# EAGLE schematic keymatrix (EAGLE 6.1)
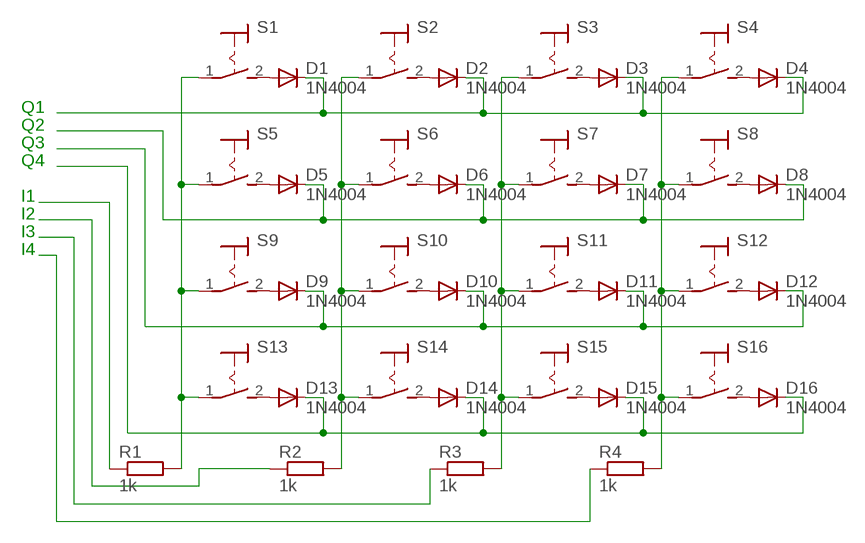
[diagram p0: schematic, sheet 1]

## Parts
D1  1N4004  [DO41-10]
D2  1N4004  [DO41-10]
D3  1N4004  [DO41-10]
D4  1N4004  [DO41-10]
D5  1N4004  [DO41-10]
D6  1N4004  [DO41-10]
D7  1N4004  [DO41-10]
D8  1N4004  [DO41-10]
D9  1N4004  [DO41-10]
D10  1N4004  [DO41-10]
D11  1N4004  [DO41-10]
D12  1N4004  [DO41-10]
D13  1N4004  [DO41-10]
D14  1N4004  [DO41-10]
D15  1N4004  [DO41-10]
D16  1N4004  [DO41-10]
R1  1k  R-EU_0204/7  [0204/7]
R2  1k  R-EU_0204/7  [0204/7]
R3  1k  R-EU_0204/7  [0204/7]
R4  1k  R-EU_0204/7  [0204/7]
S1  MS243  [MS243]
S2  MS243  [MS243]
S3  MS243  [MS243]
S4  MS243  [MS243]
S5  MS243  [MS243]
S6  MS243  [MS243]
S7  MS243  [MS243]
S8  MS243  [MS243]
S9  MS243  [MS243]
S10  MS243  [MS243]
S11  MS243  [MS243]
S12  MS243  [MS243]
S13  MS243  [MS243]
S14  MS243  [MS243]
S15  MS243  [MS243]
S16  MS243  [MS243]

## Nets
N$1: D1.A S1.2(S)
N$2: D2.A S2.2(S)
N$3: D3.A S3.2(S)
N$4: D4.A S4.2(S)
N$5: D5.A S5.2(S)
N$6: D6.A S6.2(S)
N$7: D7.A S7.2(S)
N$8: D8.A S8.2(S)
N$9: D9.A S9.2(S)
N$10: D10.A S10.2(S)
N$11: D11.A S11.2(S)
N$12: D12.A S12.2(S)
N$13: D13.A S13.2(S)
N$14: D14.A S14.2(S)
N$15: D15.A S15.2(S)
N$16: D16.A S16.2(S)
N$17: D1.C D2.C D3.C D4.C
N$18: D9.C D10.C D11.C D12.C
N$19: D13.C D14.C D15.C D16.C
N$20: R1.1
N$21: R4.2 S4.1(P) S8.1(P) S12.1(P) S16.1(P)
N$22: R3.2 S3.1(P) S7.1(P) S11.1(P) S15.1(P)
N$23: R2.2 S2.1(P) S6.1(P) S10.1(P) S14.1(P)
N$24: R1.2 S1.1(P) S5.1(P) S9.1(P) S13.1(P)
N$25: R2.1
N$26: R3.1
N$27: R4.1
N$29: D5.C D6.C D7.C D8.C

## Notes on the sheet
- Q1
- Q2
- Q3
- Q4
- I1
- I2
- I3
- I4

## Library data of the parts
D1-D16 = diode:1N4004: DIODE general purpose rectifier, 1 A
R1-R4 = rcl:R-EU_: RESISTOR, European symbol
S1-S16 = switch:MS243: TOGGLE SWITCH